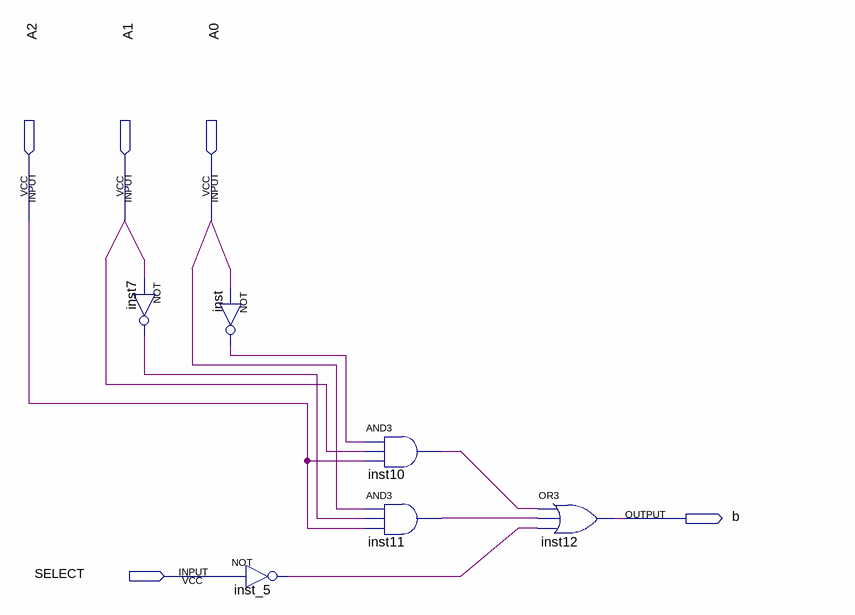
[diagram p0: schematic sheet]
// Quartus schematic segment_b.bdf as structural Verilog: 6 symbols, 5 pins
module segment_b (
  input  A2,
  input  A1,
  input  A0,
  input  SELECT,
  output b
);

  wire inst7_out, inst10_out, inst11_out, inst_5_out, inst_out;

  not inst7 (inst7_out, A1);
  not inst (inst_out, A0);
  not inst_5 (inst_5_out, SELECT);
  and inst10 (inst10_out, inst_out, A1, A2);
  and inst11 (inst11_out, A0, inst7_out, A2);
  or inst12 (b, inst10_out, inst11_out, inst_5_out);
endmodule
